# Altium schematic sheet CAN.SchDoc
size A
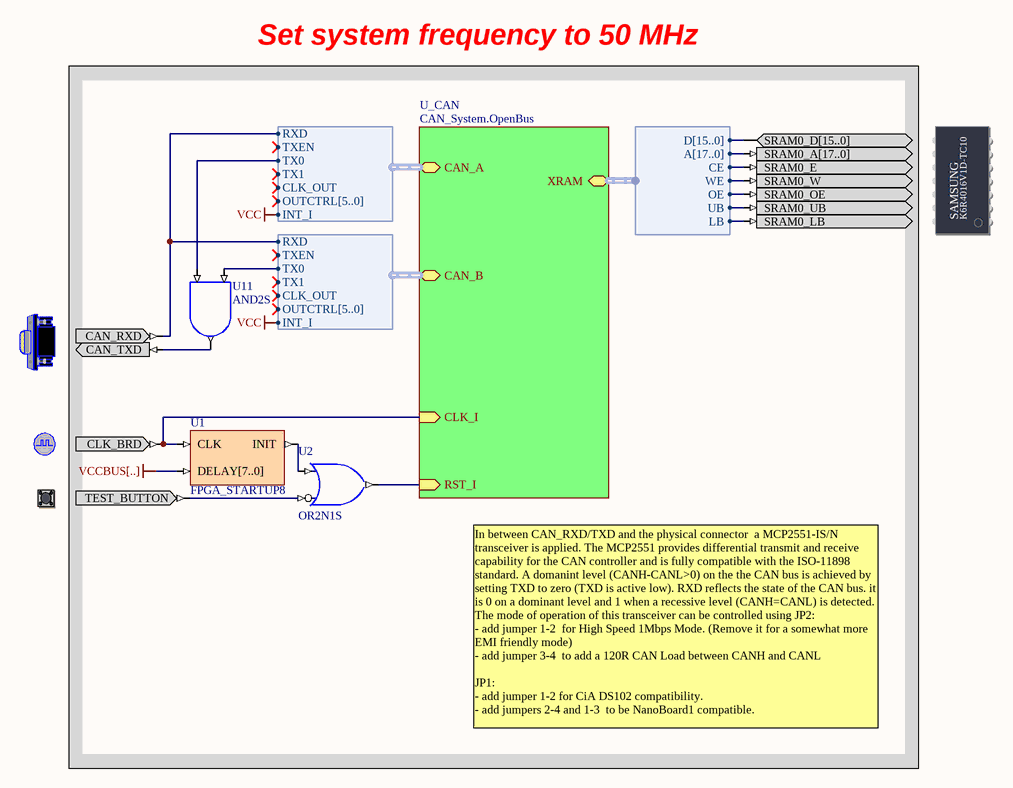
[diagram p0: CAN.SchDoc]

## Parts
(Parts that share a designator on the sheet are numbered #1, #2 ... from top to bottom, then left to right.)
?#1  SRAM_DAUGHTER0  (value not drawn)
?#2  CANCNTR  (value not drawn)
?#3  CLOCK_BOARD  (value not drawn)
?#4  TEST_BUTTON  (value not drawn)
U1  FPGA_STARTUP8
U2  OR2N1S
U11  AND2S

## Blocks framed on the sheet
Set system frequency to 50 MHz: ?#1-?#4 U1 U2 U11

## Sub-sheets
U_CAN = CAN_System.OpenBus: RST_I (in), CLK_I (in), XRAM (harness WB_MEM_CTRL_SRAM16_A18), CAN_A (harness CAN_W), CAN_B (harness CAN_W)

## Harnesses
CAN_W: RXD, TXEN, TX0, TX1, CLK_OUT, OUTCTRL[5..0], INT_I
WB_MEM_CTRL_SRAM16_A18: D[15..0], A[17..0], CE, WE, OE, UB, LB

## Nets
VCC: sheet U_CAN/CAN_B.INT_I, sheet U_CAN/CAN_A.INT_I
VCCBUS[..]: U1.DELAY[7..0]
Net?#1_SRAM0_A[17..0]: ?#1.SRAM0_A[17..0] ; sheet U_CAN/XRAM.A[17..0]
Net?#1_SRAM0_D[15..0]: ?#1.SRAM0_D[15..0] ; sheet U_CAN/XRAM.D[15..0]
Net?#1_SRAM0_E: ?#1.SRAM0_E ; sheet U_CAN/XRAM.CE
Net?#1_SRAM0_LB: ?#1.SRAM0_LB ; sheet U_CAN/XRAM.LB
Net?#1_SRAM0_OE: ?#1.SRAM0_OE ; sheet U_CAN/XRAM.OE
Net?#1_SRAM0_UB: ?#1.SRAM0_UB ; sheet U_CAN/XRAM.UB
Net?#1_SRAM0_W: ?#1.SRAM0_W ; sheet U_CAN/XRAM.WE
Net?#2_CAN_RXD: ?#2.CAN_RXD ; sheet U_CAN/CAN_B.RXD, sheet U_CAN/CAN_A.RXD
Net?#2_CAN_TXD: ?#2.CAN_TXD U11.O
Net?#3_CLK_BRD: ?#3.CLK_BRD U1.CLK ; sheet U_CAN/CLK_I
Net?#4_TEST_BUTTON: ?#4.TEST_BUTTON U2.I0
NetU1_INIT: U1.INIT U2.I1
NetU2_O: U2.O ; sheet U_CAN/RST_I
NetU11_I0: U11.I0 ; sheet U_CAN/CAN_A.TX0
NetU11_I1: U11.I1 ; sheet U_CAN/CAN_B.TX0

## Notes on the sheet
- In between CAN_RXD/TXD and the physical connector  a MCP2551-IS/N  transceiver is applied. The MCP2551 provides differential transmit and receive capability for the CAN controller and is fully compatible with the ISO-11898 standard. A domanint level (CANH-CANL>0) on the the CAN bus is achieved by setting TXD to zero (TXD is active low). RXD reflects the state of the CAN bus. it is 0 on a dominant level and 1 when a recessive level (CANH=CANL) is detected. The mode of operation of this transceiver can be controlled using JP2:
  - add jumper 1-2  for High Speed 1Mbps Mode. (Remove it for a somewhat more EMI friendly mode)
  - add jumper 3-4  to add a 120R CAN Load between CANH and CANL
  JP1:
  - add jumper 1-2 for CiA DS102 compatibility.
  - add jumpers 2-4 and 1-3  to be NanoBoard1 compatible.
- Title
- Size:
- Date:
- A
- Number:
- Time:
- Revision:
- Sheet
- of
- File:
- (in symbol SRAM_DAUGHTER0) SAMSUNG; K6R4016V1D-TC10

## Library data of the parts
?#1 = SRAM_DAUGHTER0: Free Static RAM - Daughterboard; PortComponent: True; Published: 14-May-2007; Publisher: Altium Limited; HelpURL: TR0143 NanoBoard Technical Reference Manual - NB2.pdf#page=24
?#2 = CANCNTR: CAN Bus Connector; PortComponent: True; Published: 19-Nov-2003; Publisher: Altium Limited; HelpURL: TR0143 NanoBoard Technical Reference Manual - NB2.pdf#page=39
?#3 = CLOCK_BOARD: Global System Clock Supply; PortComponent: True; Published: 19-Nov-2003; Publisher: Altium Limited; HelpURL: TR0143 Technical Reference Manual for Altium's Desktop NanoBoard NB2DSK01.pdf#page=41; UseInDSF: True
?#4 = TEST_BUTTON: Test / Reset Button; PortComponent: True; Published: 19-Nov-2003; Publisher: Altium Limited; HelpURL: TR0143 Technical Reference Manual for Altium's Desktop NanoBoard NB2DSK01.pdf#page=53
U1 = FPGA_STARTUP8: FPGA Startup With 8 Bit Delay; Published: 9-Dec-2004; Publisher: Altium Limited; HelpURL: CR0119 FPGA_STARTUPx Powerup Delay Unit.pdf; LastRevisionNo: 1.00.00; ComponentLink1Description: Core &Resource Usage; ComponentLink1URL: CR0139 FPGA Peripheral Resource Usage.pdf#page=11
U2 = OR2N1S: 2-Input OR Gate with Active Low A Input, Single Pin Version; XilinxEquivalent: OR2B1; FunctionalClass: Logic Primitive; PortSize: 2; ArchiveName: GENERIC; VHDLIB_SIM: GENERIC_LIB; Published: 29-Jan-2004; Publisher: Altium Limited; LastRevisionNo: 1.00.00; HelpURL: CR0118 FPGA Generic Library Guide.pdf#page=410; ComponentLink1URL: CR0136 FPGA Logic Primitive Resource Usage.pdf#page=187; ComponentLink1Description: Core &Resource Usage; SubClass: OR; PortStyle: Single Pin Version
U11 = AND2S: 2-Input AND Gate, Single Pin Version; XilinxEquivalent: AND2; FunctionalClass: Logic Primitive; PortSize: 2; ArchiveName: GENERIC; VHDLIB_SIM: GENERIC_LIB; Published: 29-Jan-2004; Publisher: Altium Limited; LastRevisionNo: 1.00.00; HelpURL: CR0118 FPGA Generic Library Guide.pdf#page=114; ComponentLink1URL: CR0136 FPGA Logic Primitive Resource Usage.pdf#page=13; ComponentLink1Description: Core &Resource Usage; SubClass: AND; PortStyle: Single Pin Version